# EAGLE schematic triac (EAGLE 9.3.0)
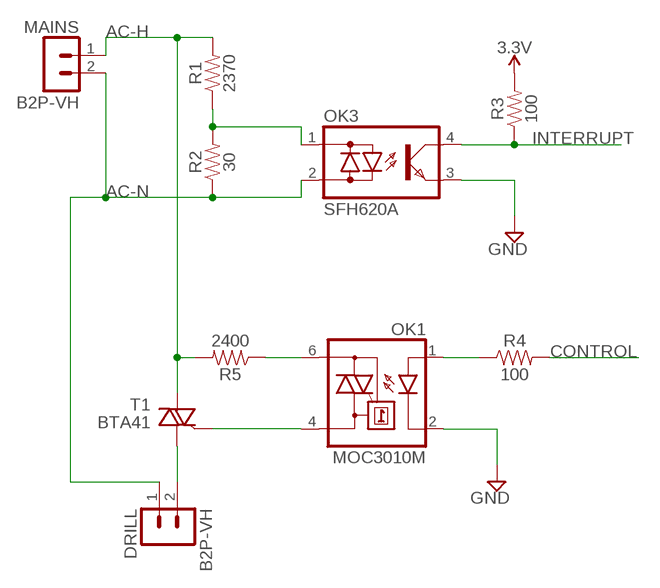
[diagram p0: schematic, sheet 1]

## Parts
DRILL  B2P-VH  [B2P-VH]
MAINS  B2P-VH  [B2P-VH]
OK1  MOC3010M  [DIL06]
OK3  SFH620A  [DIL04]
R1  2370  0.3OHM-0805-1/8W-1%  [0805]
R2  30  0.3OHM-0805-1/8W-1%  [0805]
R3  100  0.3OHM-0805-1/8W-1%  [0805]
R4  100  0.3OHM-0805-1/8W-1%  [0805]
R5  2400  0.3OHM-0805-1/8W-1%  [0805]
T1  BTA41  BTA26-H  [TOP3L-1]

## Nets
3.3V: R3.2
AC-H: MAINS.1 R1.2 R5.2 T1.A2
AC-N: DRILL.1 MAINS.2 OK3.2(AC2) R2.1
CONTROL: R4.2
GND: OK1.2(C) OK3.3(E)
INTERRUPT: OK3.4(C) R3.1
N$1: OK3.1(AC1) R1.1 R2.2
N$2: OK1.1(A) R4.1
N$3: OK1.6(A2) R5.1
N$4: OK1.4(A1) T1.G
N$5: DRILL.2 T1.A1

## Library data of the parts
DRILL MAINS = con-jst-vh:B2P-VH: HEADER
OK1 = optocoupler:MOC30*M: RANDOM-PHASE OPTOISOLATORS TRIAC DRIVER OUTPUT Source: http://www.fairchildsemi.com MOC3020-M.pdf; MF: FAIRCHILD SEMICONDUCTOR; MPN: MOC3010-M; OC_FARNELL: 1505423; OC_NEWARK: 72K8892
OK3 = optocoupler:SFH620: Optocoupler, Phototransistor Output, AC Input Source: http://www.vishay.com/docs/83675/sfh620.pdf; MPN: SFH620A-2; OC_FARNELL: 1469594; OC_NEWARK: 97K9546
R1-R5 = SparkFun-Resistors:0.3OHM: 0.3Ω resistor A resistor is a passive two-terminal electrical component that implements electrical resistance as a circuit element. Resistors act to reduce current flow, and, at the same time, act to lower voltage levels within circuits. - Wikipedia; PROD_ID: RES-11622; VALUE: 0.3
T1 = triac:BTA26: 25A TRIAC Source: http://www.st.com/stonline/products/literature/ds/7470.pdf